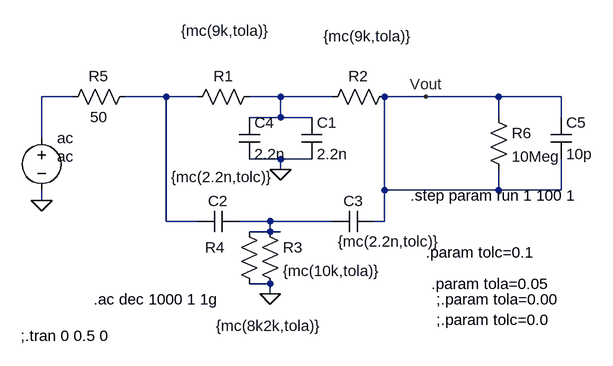
[diagram p0: schematic Twin T Notch.asc]
Twin T Notch.asc, the LTspice schematic file:
Version 4
SHEET 1 880 680
WIRE -144 80 -192 80
WIRE 0 80 -64 80
WIRE 48 80 0 80
WIRE 176 80 128 80
WIRE 256 80 176 80
WIRE 400 80 336 80
WIRE 512 80 400 80
WIRE 608 80 512 80
WIRE 176 112 176 80
WIRE 176 112 128 112
WIRE 224 112 176 112
WIRE 512 112 512 80
WIRE 608 112 608 80
WIRE -192 144 -192 80
WIRE 176 176 128 176
WIRE 224 176 176 176
WIRE 176 192 176 176
WIRE 336 224 336 80
WIRE 512 224 512 192
WIRE 512 224 336 224
WIRE 608 224 608 176
WIRE 608 224 512 224
WIRE -192 240 -192 224
WIRE 0 272 0 80
WIRE 48 272 0 272
WIRE 160 272 112 272
WIRE 256 272 160 272
WIRE 336 272 336 224
WIRE 336 272 320 272
WIRE 160 288 160 272
WIRE 160 288 128 288
WIRE 176 288 160 288
WIRE 160 368 128 368
WIRE 160 384 160 368
FLAG 176 192 0
FLAG 400 80 Vout
FLAG -192 240 0
FLAG 160 384 0
SYMBOL res 144 64 R90
WINDOW 0 0 56 VBottom 2
WINDOW 3 -101 53 VTop 2
SYMATTR InstName R1
SYMATTR Value {mc(9k,tola)}
SYMBOL res 352 64 R90
WINDOW 0 0 56 VBottom 2
WINDOW 3 -93 42 VTop 2
SYMATTR InstName R2
SYMATTR Value {mc(9k,tola)}
SYMBOL cap 112 256 R90
WINDOW 0 0 32 VBottom 2
WINDOW 3 -68 26 VTop 2
SYMATTR InstName C2
SYMATTR Value {mc(2.2n,tolc)}
SYMBOL cap 320 256 R90
WINDOW 0 0 32 VBottom 2
WINDOW 3 31 -23 VTop 2
SYMATTR InstName C3
SYMATTR Value {mc(2.2n,tolc)}
SYMBOL voltage -192 128 R0
WINDOW 3 24 44 Left 2
WINDOW 123 0 0 Left 0
WINDOW 39 0 0 Left 0
SYMATTR Value ac
SYMATTR InstName ac
SYMBOL cap 208 112 R0
SYMATTR InstName C1
SYMATTR Value 2.2n
SYMBOL cap 112 112 R0
SYMATTR InstName C4
SYMATTR Value 2.2n
SYMBOL res 144 272 R0
SYMATTR InstName R3
SYMATTR Value {mc(10k,tola)}
SYMBOL res 112 272 R0
WINDOW 0 -52 40 Left 2
WINDOW 3 -35 161 Left 2
SYMATTR InstName R4
SYMATTR Value {mc(8k2k,tola)}
SYMBOL res -48 64 R90
WINDOW 0 0 56 VBottom 2
WINDOW 3 32 56 VTop 2
SYMATTR InstName R5
SYMATTR Value 50
SYMBOL res 496 96 R0
SYMATTR InstName R6
SYMATTR Value 10Meg
SYMBOL cap 592 112 R0
SYMATTR InstName C5
SYMATTR Value 10p
TEXT -112 392 Left 2 !.ac dec 1000 1 1g
TEXT 408 368 Left 2 !.param tola=0.05
TEXT 400 320 Left 2 !.param tolc=0.1
TEXT 376 232 Left 2 !.step param run 1 100 1
TEXT 416 424 Left 2 !;.param tolc=0.0
TEXT 416 392 Left 2 !;.param tola=0.00
TEXT -224 448 Left 2 !;.tran 0 0.5 0

The netlist it stands for:
* Twin T Notch.asc
R1 N003 N002 {mc(9k,tola)}
R2 Vout N003 {mc(9k,tola)}
C2 N004 N002 {mc(2.2n,tolc)}
C3 Vout N004 {mc(2.2n,tolc)}
V§ac N001 0 ac
C1 N003 0 2.2n
C4 N003 0 2.2n
R3 N004 0 {mc(10k,tola)}
R4 N004 0 {mc(8k2k,tola)}
R5 N002 N001 50
R6 Vout Vout 10Meg
C5 Vout Vout 10p
.ac dec 1000 1 1g
.param tola=0.05
.param tolc=0.1
.step param run 1 100 1
;.param tolc=0.0
;.param tola=0.00
;.tran 0 0.5 0
.backanno
.end